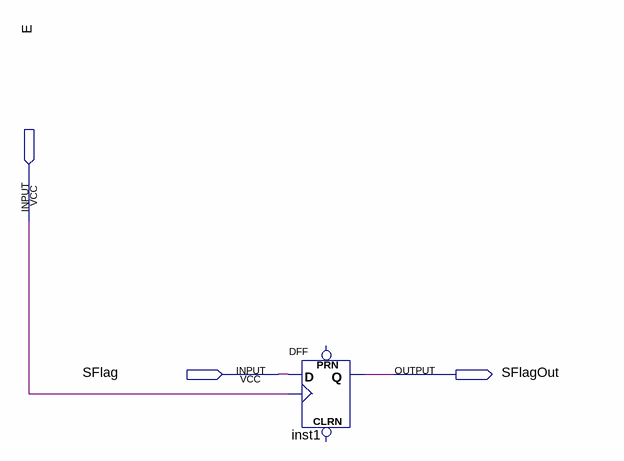
[diagram p0: schematic sheet]
// Quartus schematic FLAG_REGISTERS.bdf as structural Verilog: 1 symbols, 3 pins
module FLAG_REGISTERS (
  input  E,
  input  SFlag,
  output SFlagOut
);

  DFF inst1 (.CLK(E), .D(SFlag), .Q(SFlagOut));  // open: CLRN, PRN
endmodule
